# EAGLE design debugger-board (EAGLE 7.6.0)
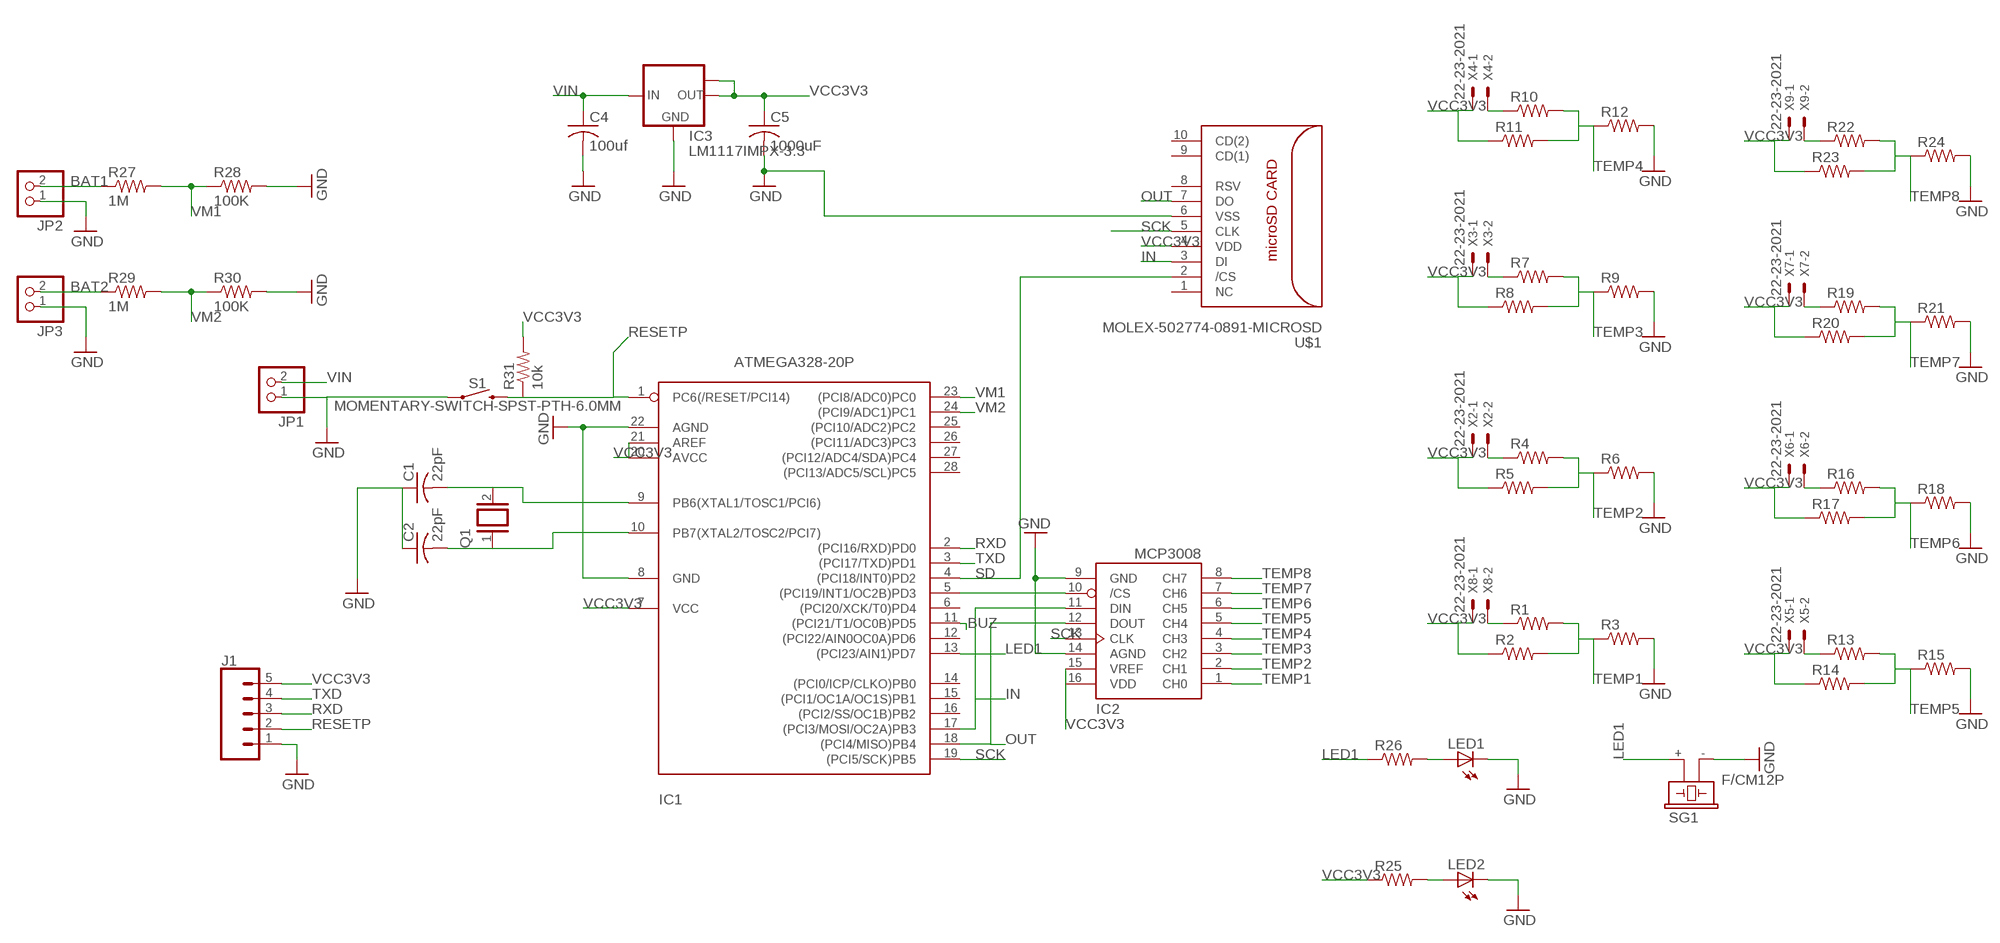
[diagram p0: schematic, sheet 1]

## Parts
C1  22pF  C-US050-025X075  [C050-025X075]
C2  22pF  C-US050-025X075  [C050-025X075]
C4  100uf  C-US050-025X075  [C050-025X075]
C5  1000uF  C-US050-025X075  [C050-025X075]
IC1  ATMEGA328-20P  [DIL28-3]
IC2  MCP3008  [DIL16]
IC3  LM1117IMPX-3.3  [SOT223]
J1  CONN_05PTH_LONGPADS  [1X05_LONGPADS]
JP1  PINHD-1X2  [1X02]
JP2  PINHD-1X2  [1X02]
JP3  PINHD-1X2  [1X02]
LED1  LED_ELD260  [LED_LD260]
LED2  LED_ELD260  [LED_LD260]
Q1  XTAL/S  [QS]
R1  R-US_0204/5  [0204/5]
R2  R-US_0204/5  [0204/5]
R3  R-US_0204/5  [0204/5]
R4  R-US_0204/5  [0204/5]
R5  R-US_0204/5  [0204/5]
R6  R-US_0204/5  [0204/5]
R7  R-US_0204/5  [0204/5]
R8  R-US_0204/5  [0204/5]
R9  R-US_0204/5  [0204/5]
R10  R-US_0204/5  [0204/5]
R11  R-US_0204/5  [0204/5]
R12  R-US_0204/5  [0204/5]
R13  R-US_0204/5  [0204/5]
R14  R-US_0204/5  [0204/5]
R15  R-US_0204/5  [0204/5]
R16  R-US_0204/5  [0204/5]
R17  R-US_0204/5  [0204/5]
R18  R-US_0204/5  [0204/5]
R19  R-US_0204/5  [0204/5]
R20  R-US_0204/5  [0204/5]
R21  R-US_0204/5  [0204/5]
R22  R-US_0204/5  [0204/5]
R23  R-US_0204/5  [0204/5]
R24  R-US_0204/5  [0204/5]
R25  R-US_0204/5  [0204/5]
R26  R-US_0204/5  [0204/5]
R27  1M  R-US_0204/5  [0204/5]
R28  100K  R-US_0204/5  [0204/5]
R29  1M  R-US_0204/5  [0204/5]
R30  100K  R-US_0204/5  [0204/5]
R31  10k  R-US_0207/7  [0207/7]
S1  MOMENTARY-SWITCH-SPST-PTH-6.0MM  [TACTILE_SWITCH_PTH_6.0MM]
SG1  F/CM12P  [F/CM12P]
U$1  MOLEX-502774-0891-MICROSD  [MOLEX-502774-0891-MICROSD]
X2  22-23-2021  [22-23-2021]
X3  22-23-2021  [22-23-2021]
X4  22-23-2021  [22-23-2021]
X5  22-23-2021  [22-23-2021]
X6  22-23-2021  [22-23-2021]
X7  22-23-2021  [22-23-2021]
X8  22-23-2021  [22-23-2021]
X9  22-23-2021  [22-23-2021]

## Nets
BAT1: JP2.2 R27.1
BAT2: JP3.2 R29.1
BUZ: IC1.11((PCI21/T1/OC0B)PD5)
GND: C1.1 C2.1 C4.2 C5.2 IC1.8(GND) IC1.22(AGND) IC2.9(GND) IC2.14(AGND) IC3.1(GND) J1.1 JP1.1 JP2.1 JP3.1 LED1.K(C) LED2.K(C) R3.2 R6.2 R9.2 R12.2 R15.2 R18.2 R21.2 R24.2 R28.2 R30.2 S1.1 SG1.- U$1.6(VSS)
IN: IC1.17((PCI3/MOSI/OC2A)PB3) IC2.11(DIN) U$1.3(DI)
LED1: IC1.13((PCI23/AIN1)PD7) R26.1 SG1.+
N$1: LED2.A R25.2
N$4: IC1.5((PCI19/INT1/OC2B)PD3) IC2.10(/CS)
N$5: C1.2 IC1.9(PB6(XTAL1/TOSC1/PCI6)) Q1.2
N$6: C2.2 IC1.10(PB7(XTAL2/TOSC2/PCI7)) Q1.1
N$7: R4.1 X2.2
N$8: R1.1 X8.2
N$10: LED1.A R26.2
N$11: R7.1 X3.2
N$13: R10.1 X4.2
N$15: R13.1 X5.2
N$17: R16.1 X6.2
N$19: R19.1 X7.2
N$21: R22.1 X9.2
OUT: IC1.18((PCI4/MISO)PB4) IC2.12(DOUT) U$1.7(DO)
RESETP: IC1.1(PC6(/RESET/PCI14)) J1.2 R31.1 S1.3
RXD: IC1.2((PCI16/RXD)PD0) J1.3
SCK: IC1.19((PCI5/SCK)PB5) IC2.13(CLK) U$1.5(CLK)
SD: IC1.4((PCI18/INT0)PD2) U$1.2(/CS)
TEMP1: IC2.1(CH0) R1.2 R2.2 R3.1
TEMP2: IC2.2(CH1) R4.2 R5.2 R6.1
TEMP3: IC2.3(CH2) R7.2 R8.2 R9.1
TEMP4: IC2.4(CH3) R10.2 R11.2 R12.1
TEMP5: IC2.5(CH4) R13.2 R14.2 R15.1
TEMP6: IC2.6(CH5) R16.2 R17.2 R18.1
TEMP7: IC2.7(CH6) R19.2 R20.2 R21.1
TEMP8: IC2.8(CH7) R22.2 R23.2 R24.1
TXD: IC1.3((PCI17/TXD)PD1) J1.4
VCC3V3: C5.1 IC1.7(VCC) IC1.20(AVCC) IC1.21(AREF) IC2.15(VREF) IC2.16(VDD) IC3.2(OUT) IC3.TAB(OUT1) J1.5 R2.1 R5.1 R8.1 R11.1 R14.1 R17.1 R20.1 R23.1 R25.1 R31.2 U$1.4(VDD) X2.1 X3.1 X4.1 X5.1 X6.1 X7.1 X8.1 X9.1
VIN: C4.1 IC3.3(IN) JP1.2
VM1: IC1.23((PCI8/ADC0)PC0) R27.2 R28.1
VM2: IC1.24((PCI9/ADC1)PC1) R29.2 R30.1
Unconnected: IC1.6((PCI20/XCK/T0)PD4) IC1.12((PCI22/AIN0OC0A)PD6) IC1.14((PCI0/ICP/CLKO)PB0) IC1.15((PCI1/OC1A/OC1S)PB1) IC1.16((PCI2/SS/OC1B)PB2) IC1.25((PCI10/ADC2)PC2) IC1.26((PCI11/ADC3)PC3) IC1.27((PCI12/ADC4/SDA)PC4) IC1.28((PCI13/ADC5/SCL)PC5) U$1.1(NC) U$1.8(RSV) U$1.9(CD(1)) U$1.10(CD(2))

## Library data of the parts
C1 C2 = adafruit:C-US: CAPACITOR, American symbol
C4 C5 = resistor:C-US: CAPACITOR, American symbol
IC1 = atmega328:ATMEGA328*P: MICROCONTROLLER 32 kBytes FLASH 2 kBytes SRAM 1 kBytes EEPROM USART 8-channel 10 bit ADC
IC2 = adafruit:MCP3008
IC3 = lm1117:LM1117IMPX-*
J1 = SparkFun-Connectors:CONN_05: Multi connection point. Often used as Generic Header-pin footprint for 0.1 inch spaced/style header connections On any of the 0.1 inch spaced packages, you can populate with these: Break Away Headers - Straight <https://www.sparkfun.com/products/116> (PRT-00116) Break Away Male Headers - Right Angle <https://www.sparkfun.com/products/553> (PRT-00553) Female Headers <https://www.sparkfun.com/products/115> (PRT-00115) Break Away Headers - Machine Pin <https://www.sparkfun.com/products/117> (PRT-00117) Break Away Female Headers - Swiss Machine Pin <https://www.sparkfun.com/products/743> (PRT-00743) For SCREWTERMINALS and SPRING TERMINALS visit here: Screw Terimnals on SparkFun.com <https://www.sparkfun.com/search/results?term=Screw+Terminals> (5mm/3.5mm/2.54mm spacing) This device is also useful as a general connection point to wire up your design to another part of your project. Our various solder wires solder well into these plated through hole pads. Hook-Up Wire - Assortment (Stranded, 22 AWG) <https://www.sparkfun.com/products/11375> (PRT-11375) Hook-Up Wire - Assortment (Solid Core, 22 AWG) <https://www.sparkfun.com/products/11367> (PRT-11367) View the entire wire category on our website here <https://www.sparkfun.com/categories/141> Special notes: Molex polarized connector foot print use with SKU : PRT-08231 with associated crimp pins and housings. 1MM SMD Version SKU: PRT-10208
JP1-JP3 = pinhead:PINHD-1X2: PIN HEADER
LED1 LED2 = eagle-ltspice:LED_E: LED Source: http://www.osram.convergy.de Source: www.luxeon.com Source: www.kingbright.com; SPICEMODEL: NONE; SPICEPREFIX: D; SPICETYPE: diode
Q1 = special:XTAL/S: CRYSTAL
R1-R30 = adafruit:R-US_: RESISTOR, American symbol
R31 = resistor:R-US_: RESISTOR, American symbol
S1 = SparkFun-Switches:MOMENTARY-SWITCH-SPST: Momentary Switch (Pushbutton) - SPST Normally-open (NO) SPST momentary switches (buttons, pushbuttons). Variants PTH-12MM - 12mm square, through-hole Momentary Pushbutton Switch - 12mm Square <https://www.sparkfun.com/products/9190> (COM-09190) PTH-6.0MM, PTH-6.0MM-KIT - 6.0mm square, through-hole Mini Pushbutton Switch <https://www.sparkfun.com/products/97> (COM-00097) KIT package intended for soldering kit's - only one side of pads' copper is exposed. PTH-RIGHT-ANGLE-KIT - Right-angle, through-hole Right Angle Tactile Button <https://www.sparkfun.com/products/10791> - Used on SparkFun BigTime Watch Kit <https://www.sparkfun.com/products/11734> SMD-12MM - 12mm square, surface-mount Tactile Button - SMD (12mm) <https://www.sparkfun.com/products/12993> (COM-12993) Used on SparkFun PicoBoard <https://www.sparkfun.com/products/11888> SMD-4.5MM - 4.5mm Square Trackball Switch Used on SparkFun Blackberry Trackballer Breakout <https://www.sparkfun.com/products/13169> SMD-4.6MMX2.8MM - 4.60mm x 2.80mm, surface mount Used on SparkFun SAMD21 Mini Breakout <https://www.sparkfun.com/products/13664> SMD-5.2MM, SMD-5.2-REDUNDANT - 5.2mm square, surface-mount Mini Pushbutton Switch - SMD <https://www.sparkfun.com/products/8720> (COM-08720) Used on Arduino Pro Mini <https://www.sparkfun.com/products/11114> REDUNDANT package connects both switch circuits together SMD-6.0X3.5MM - 6.0 x 3.5mm, surface mount Momentary Reset Switch SMD <https://www.sparkfun.com/products/8229> (COM-08229) SMD-6.2MM-TALL - 6.2mm square, surface mount Tactile Button - SMD (6mm) <https://www.sparkfun.com/products/12992> Used on SparkFun Digital Sandbox <https://www.sparkfun.com/products/12651> SMD-RIGHT-ANGLE - Right-angle, surface mount Used on SparkFun Block for Intel® Edison - Arduino <https://www.sparkfun.com/products/13036>; PROD_ID: SWCH-08441; SF_SKU: COM-00097
SG1 = buzzer:F/CM12P: BUZZER Source: Buerklin; OC_FARNELL: unknown; OC_NEWARK: unknown
U$1 = Ava:MOLEX-502774-0891-MICROSD; FARNELL: 2064063
X2-X9 = con-molex:22-23-2021: .100" (2.54mm) Center Header - 2 Pin; MF: MOLEX; MPN: 22-23-2021; OC_FARNELL: 1462926; OC_NEWARK: 25C3832

## Board
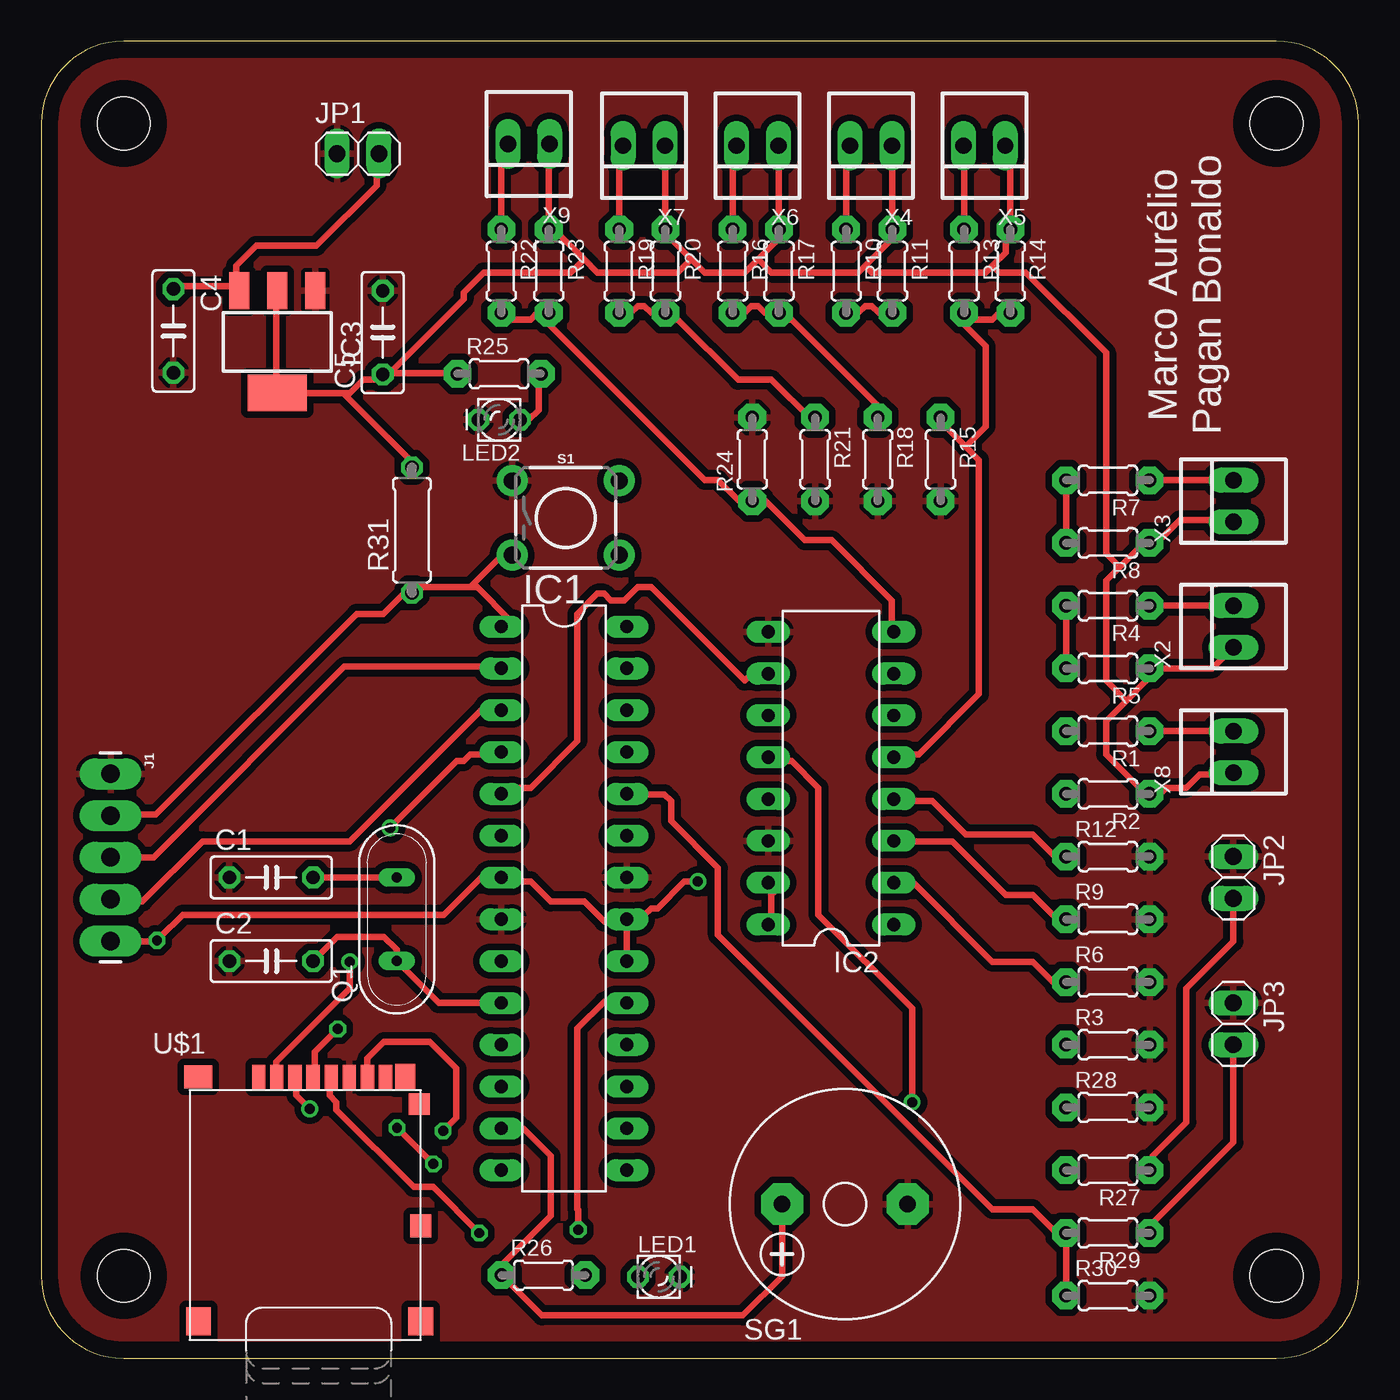
[diagram p1: board, top side]
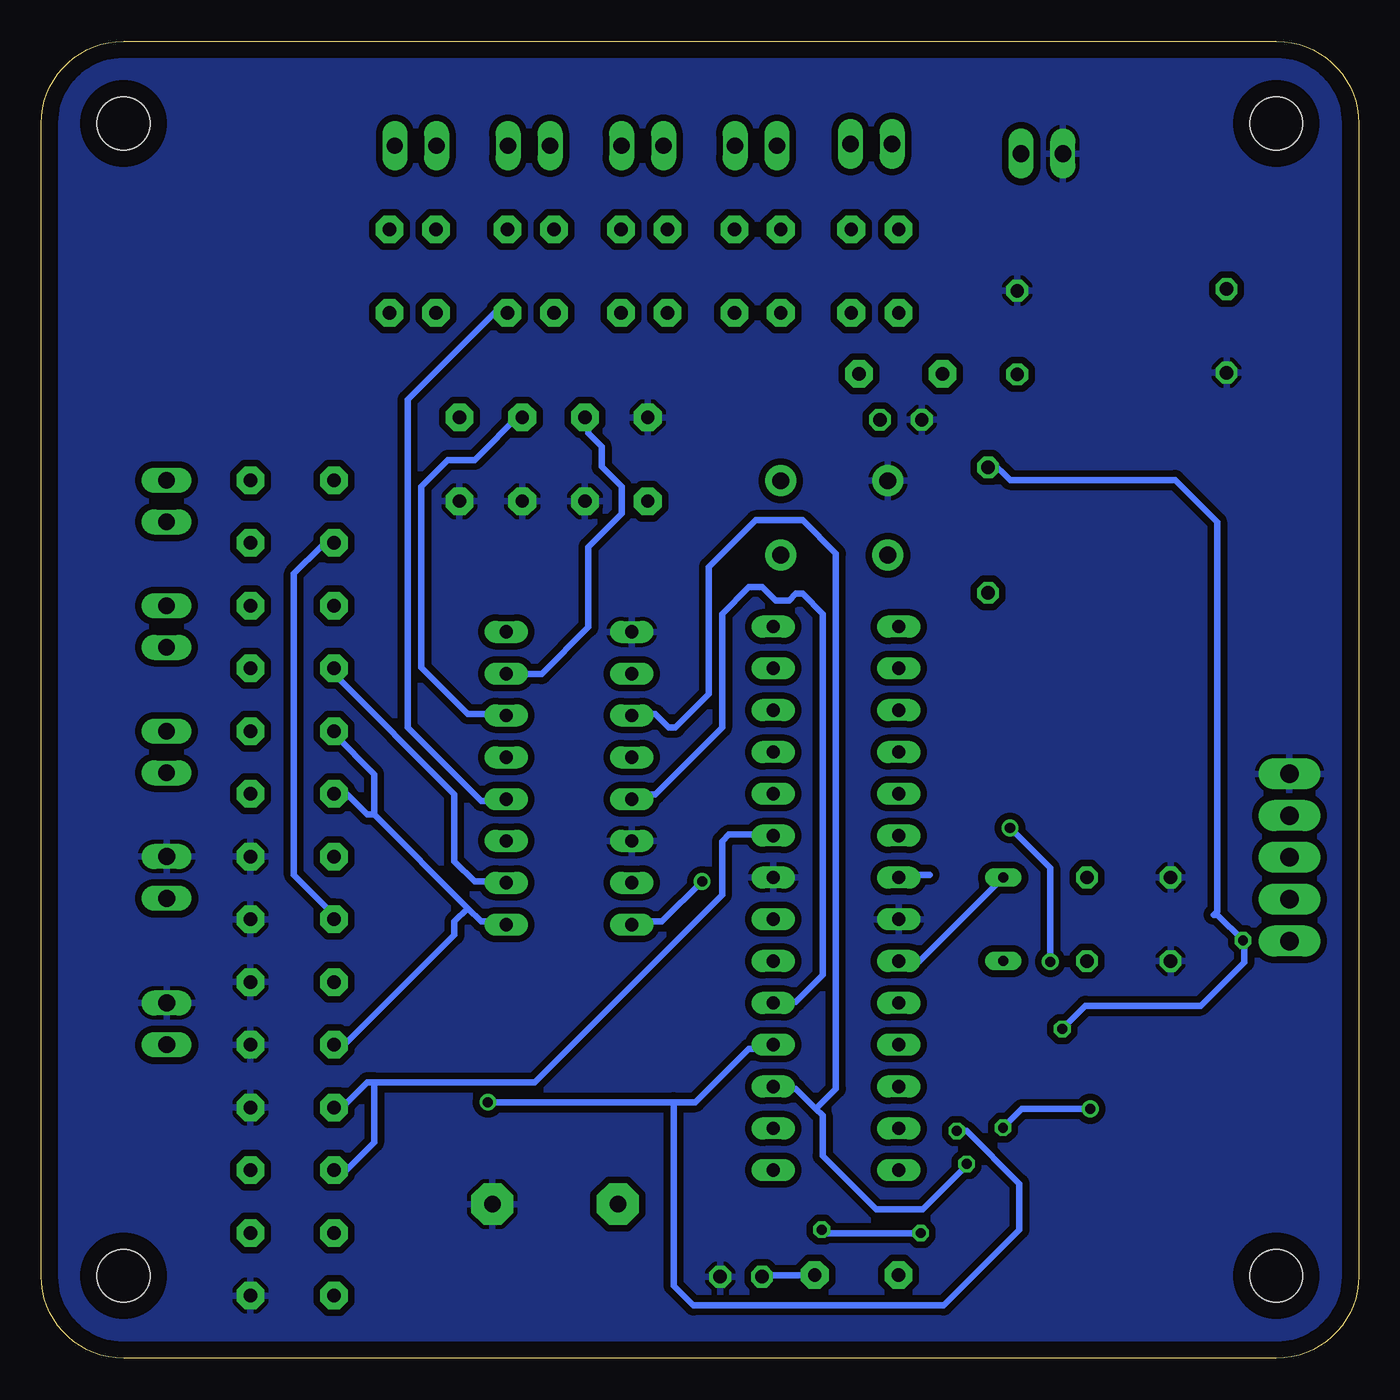
[diagram p2: board, bottom side, seen from below]

Size 80.01 x 80.01 mm. Coordinates in mm from the lower left corner, seen from the top.
Outline: 80.01,5 80.01,75.01 arc90 75.01,80.01 5,80.01 arc90 0,75.01 0,5 arc90 5,0 75.01,0 arc90 80.01,5
Copper layers (1*16): Top 0.035mm / dielectric 1.5mm / Bottom 0.035mm
Design rules "default *": minimum track width 16mil, minimum drill 24mil, track to track 16mil, track to pad 16mil, pad to pad 16mil, via to via 16mil, smd to smd 16mil, copper to edge 40mil, drill to drill 16mil, minimum pad ring 10mil, minimum via ring 8mil, stop-mask expansion 4mil, vias tented up to drill 0mil, thermal gap 10mil
Holes 3.2 mm at 75.01,75.01 75.01,5.01 5.01,5.01 5.01,75.01

### Footprints (pad centres in the part's own frame; a part is rotated, then mirrored left to right if it is on the bottom)
C050-025X075 = drill 0.813 octagon: 1 -2.54,0; 2 2.54,0
DIL28-3 = drill 0.813 long: 1 -16.51,-3.81; 2 -13.97,-3.81; 3 -11.43,-3.81; 4 -8.89,-3.81; 5 -6.35,-3.81; 6 -3.81,-3.81; 7 -1.27,-3.81; 8 1.27,-3.81; 9 3.81,-3.81; 10 6.35,-3.81; 11 8.89,-3.81; 12 11.43,-3.81; 13 13.97,-3.81; 14 16.51,-3.81; 15 16.51,3.81; 16 13.97,3.81; 17 11.43,3.81; 18 8.89,3.81; 19 6.35,3.81; 20 3.81,3.81; 21 1.27,3.81; 22 -1.27,3.81; 23 -3.81,3.81; 24 -6.35,3.81; 25 -8.89,3.81; 26 -11.43,3.81; 27 -13.97,3.81; 28 -16.51,3.81
DIL16 = drill 0.813 long: 1 -8.89,-3.81; 2 -6.35,-3.81; 3 -3.81,-3.81; 4 -1.27,-3.81; 5 1.27,-3.81; 6 3.81,-3.81; 7 6.35,-3.81; 8 8.89,-3.81; 9 8.89,3.81; 10 6.35,3.81; 11 3.81,3.81; 12 1.27,3.81; 13 -1.27,3.81; 14 -3.81,3.81; 15 -6.35,3.81; 16 -8.89,3.81
SOT223 = smd 1.219 x 2.235: 1 -2.311,-3.099; 2 0,-3.099; 3 2.311,-3.099 | smd 3.6 x 2.2: TAB 0,3.099
1X05_LONGPADS = drill 1.118 pad 1.88 long: 1 0,0; 2 2.54,0; 3 5.08,0; 4 7.62,0; 5 10.16,0
1X02 = drill 1.016 long: 1 -1.27,0; 2 1.27,0
LED_LD260 = drill 0.813 octagon: A -1.27,0; K 1.27,0
QS = drill 0.61 long: 1 -2.54,0; 2 2.54,0
0204/5 = drill 0.813 pad 1.676 octagon: 1 -2.54,0; 2 2.54,0
0207/7 = drill 0.813 octagon: 1 -3.81,0; 2 3.81,0
TACTILE_SWITCH_PTH_6.0MM = drill 1.016 pad 1.88: 1 -3.251,2.261; 2 3.251,2.261; 3 -3.251,-2.261; 4 3.251,-2.261
F/CM12P = drill 1.016 pad 2.54 octagon: + 3.81,0; - -3.81,0
MOLEX-502774-0891-MICROSD = smd 0.8 x 1.5: 1 -3.3,8.2; 2 -2.2,8.2; 3 -1.1,8.2; 4 0,8.2; 5 1.1,8.2; 6 2.2,8.2; 7 3.3,8.2; 8 4.4,8.2 | smd 1.29 x 1.3: 9 6.455,6.55 | smd 1.29 x 1.4: 10 6.54,-0.85 | smd 1.5 x 1.7: 11 6.54,-6.65; 12 -6.96,-6.65 | smd 1.7 x 1.4: 14 -6.96,8.2 | smd 1.2 x 1.6: 15 5.6,8.2
22-23-2021 = drill 1 long: 1 -1.27,0; 2 1.27,0

### Placement (x,y rotation side)
C1  13.97,29.21 0 top
C2  13.97,24.13 0 top
C4  8.03,62.41 270 top
C5  20.74,62.31 90 top
IC1  31.75,27.94 270 top
IC2  47.96,35.24 90 top
IC3  14.34,61.75 180 top
J1  4.21,35.51 270 top
JP1  19.24,73.18 0 top
JP2  72.39,29.21 270 top
JP3  72.39,20.32 270 top
LED1  37.51,4.96 0 top
LED2  27.81,57.01 180 top
Q1  21.59,26.67 90 top
R1  64.77,38.1 180 top
R2  64.77,34.29 180 top
R3  64.77,19.05 0 top
R4  64.77,45.72 180 top
R5  64.77,41.91 180 top
R6  64.77,22.86 0 top
R7  64.77,53.34 180 top
R8  64.77,49.53 180 top
R9  64.77,26.67 0 top
R10  48.88,66.04 270 top
R11  51.69,66.04 270 top
R12  64.77,30.48 0 top
R13  56.04,66.04 270 top
R14  58.85,66.04 270 top
R15  54.61,54.61 270 top
R16  41.99,66.04 270 top
R17  44.8,66.04 270 top
R18  50.8,54.61 270 top
R19  35.1,66.04 270 top
R20  37.91,66.04 270 top
R21  46.99,54.61 270 top
R22  27.94,66.04 270 top
R23  30.82,66.04 270 top
R24  43.18,54.61 90 top
R25  27.81,59.81 0 top
R26  30.5,5.05 0 top
R27  64.77,11.43 180 top
R28  64.77,15.24 0 top
R29  64.77,7.62 180 top
R30  64.77,3.81 0 top
R31  22.51,50.31 90 top
S1  31.85,51.05 0 top
SG1  48.8,9.37 180 top
U$1  16.51,8.89 0 top
X2  72.39,44.45 90 top
X3  72.39,52.07 90 top
X4  50.38,73.66 180 top
X5  57.27,73.66 180 top
X6  43.49,73.66 180 top
X7  36.6,73.66 180 top
X8  72.39,36.83 90 top
X9  29.61,73.76 180 top

### Tracks (layer width: path | path; a pad name or v marks a point on that pad's centre or on a via)
BAT1
  Top 0.406: JP2.2 72.39,27.75 72.39,25.31 69.54,22.47 69.54,14.34 67.51,12.31 67.51,11.49 R27.1
BAT2
  Top 0.406: JP3.2 72.39,18.81 72.39,13.12 67.1,7.84 R29.1
GND
  pour Bottom: 80.01,5 80.01,75.01 arc90 75.01,80.01 5,80.01 arc90 0,75.01 0,5 arc90 5,0 75.01,0 arc90
  pour Top: 0,5 0,75.01 arc-90 5,80.01 75.01,80.01 arc-90 80.01,75.01 80.01,5 arc-90 75.01,0 5,0 arc-90
IN  (via drill 0.6, 0.61)
  Top 0.406: v16.3,15.15 15.49,15.96 15.49,16.78 U$1.3 | v21.61,14.01 v23.81,11.81
  Bottom 0.406: v16.3,15.15 20.47,15.15 v21.61,14.01 | 32.97,15.15 34.19,16.37 35.4,16.37 IC1.17 | 32.97,15.15 32.56,14.75 32.56,12.31 29.31,9.06 26.46,9.06 23.81,11.71 v23.81,11.81 | 32.97,15.15 31.75,16.37 31.75,48.88 33.78,50.92 36.62,50.92 39.47,48.07 39.47,40.35 41.5,38.32 41.91,38.32 42.72,39.13 43.94,39.13 IC2.11
LED1
  Top 0.406: IC1.13 28.09,13.93 29.31,13.93 30.93,12.31 30.93,8.65 27.68,5.4 R26.1 30.4,2.61 42.61,2.61 44.99,4.99 SG1.+
N$1
  Top 0.406: LED2.A 29.61,57.01 30.21,57.61 30.21,59.67 R25.2
N$4
  Top 0.406: IC1.5 28.09,34.66 29.72,34.66 32.56,37.5 32.56,45.23 33.78,46.45 34.19,46.45 34.59,46.04 35.4,46.04 36.22,46.85 37.03,46.85 42.72,41.16 43.13,41.57 43.94,41.57 IC2.10
N$5
  Top 0.406: C1.2 Q1.2
  Bottom 0.406: Q1.2 26.67,24.13 IC1.9
N$6
  Top 0.406: C2.2 17.99,25.61 20.81,25.61 21.59,24.83 Q1.1 24.13,21.59 IC1.10
N$7
  Top 0.406: R4.1 X2.2
N$8
  Top 0.406: R1.1 X8.2
N$10
  Bottom 0.406: R26.2 36.15,5.05 LED1.A
N$11
  Top 0.406: R7.1 X3.2
N$13
  Top 0.406: R10.1 48.88,73.43 X4.2
N$15
  Top 0.406: R13.1 56.04,73.62 X5.2
N$17
  Top 0.406: R16.1 41.99,73.43 X6.2
N$19
  Top 0.406: R19.1 35.1,73.43 X7.2
N$21
  Top 0.406: R22.1 27.94,73.36 X9.2
OUT  (via drill 0.6, 0.61)
  Top 0.406: v52.88,15.56 52.88,21.25 47.19,26.94 47.19,34.66 45.56,36.28 44.35,36.28 IC2.12 | U$1.7 19.81,18.21 20.81,19.21 23.61,19.21 25.21,17.61 25.21,14.61 v24.41,13.81
  Bottom 0.406: v52.88,15.56 41.61,15.56 | 41.61,15.56 40.28,15.56 37.03,18.81 35.81,18.81 IC1.18 | v24.41,13.81 23.81,13.81 20.61,10.61 20.61,7.81 25.21,3.21 40.41,3.21 41.61,4.41 41.61,15.56
RESETP
  Top 0.406: 26.06,46.85 26.46,46.85 28.5,44.82 28.09,44.41 IC1.1 | 26.06,46.85 22.81,46.85 R31.1 22.4,46.85 20.77,45.23 19.15,45.23 6.96,33.03 4.52,33.03 J1.2 | 26.06,46.85 27.68,48.48 28.5,48.48 S1.3
RXD
  Top 0.406: J1.3 6.83,30.43 18.41,42.01 27.84,42.01 IC1.2
SCK  (via drill 0.6)
  Top 0.406: U$1.5 17.52,16.78 17.52,15.96 17.93,15.56 17.93,15.09 22.61,10.41 23.81,10.41 v26.61,7.61 | IC1.19 35.4,21.65 34.19,21.65 32.56,20.03 32.56,9.06 32.61,9.01 v32.61,7.81
  Bottom 0.406: IC2.13 43.94,34.25 42.72,34.25 38.66,38.32 38.66,45.23 37.03,46.85 36.22,46.85 35.4,46.04 34.59,46.04 34.19,46.45 33.78,46.45 32.56,45.23 32.56,23.28 34.19,21.65 35.4,21.65 IC1.19 | v26.61,7.61 32.41,7.61 v32.61,7.81
SD  (via drill 0.61)
  Top 0.406: v18.74,24.09 18.74,22.47 14.27,18 14.27,17.18 U$1.2 | v21.18,32.22 25.24,36.28 25.65,36.28 26.06,36.69 27.68,36.69 IC1.4
  Bottom 0.406: v18.74,24.09 18.74,29.78 v21.18,32.22
TEMP1
  Bottom 0.406: 59.79,33.03 54.1,27.34 | 54.1,27.34 53.29,26.53 52.07,26.53 IC2.1 | 59.79,33.03 60.2,33.03 61.41,34.25 62.23,34.25 R2.2 | 54.1,27.34 54.91,26.53 54.91,25.72 61.41,19.22 62.23,19.22 R3.1 | 59.79,33.03 59.79,35.47 62.23,37.91 R1.2
TEMP2
  Top 0.406: IC2.2 52.07,28.97 52.88,28.97 57.76,24.09 60.2,24.09 61.41,22.87 62.23,22.87 R6.1 | R5.2 R4.2
  Bottom 0.406: R5.2 62.23,41.57 54.91,34.25 54.91,30.19 53.69,28.97 52.07,28.97 IC2.2
TEMP3
  Top 0.406: IC2.3 52.07,31.41 55.32,31.41 58.57,28.16 60.2,28.16 61.41,26.94 62.23,26.94 R9.1 | R7.2 R8.2
  Bottom 0.406: R8.2 62.63,49.29 63.04,49.29 64.67,47.66 64.67,29.38 62.63,27.34 62.23,27.34 61.82,26.94 62.23,26.53 R9.1
TEMP4
  Top 0.406: R10.2 49.22,63.51 49.63,63.51 50.04,63.92 50.44,63.92 50.85,63.51 51.66,63.51 R11.2 | IC2.4 52.07,33.85 54.1,33.85 56.13,31.81 60.2,31.81 61.41,30.6 62.23,30.6 R12.1
  Bottom 0.406: R11.2 52.07,63.51 52.47,63.51 57.76,58.23 57.76,38.32 53.29,33.85 52.07,33.85 IC2.4
TEMP5
  Top 0.406: 56.13,63.11 57.76,63.11 58.16,63.51 58.57,63.51 R14.2 | 56.13,55.39 54.51,57.01 R15.1 | 56.13,55.39 56.94,54.57 56.94,40.35 53.29,36.69 52.07,36.69 IC2.5 | 56.13,63.11 56.13,62.7 57.35,61.48 57.35,56.61 56.13,55.39 | 56.13,63.11 R13.2
TEMP6
  Top 0.406: R16.2 42.31,63.51 42.72,63.51 43.13,63.92 43.53,63.92 43.94,63.51 44.75,63.51 R17.2 45.16,63.11 45.56,63.11 51.25,57.42 50.85,57.01 R18.1
  Bottom 0.406: IC2.6 52.07,39.13 54.1,39.13 56.94,41.97 56.94,52.95 55.32,54.57 53.69,54.57 50.85,57.42 R18.1
TEMP7
  Top 0.406: R19.2 35.4,63.51 35.81,63.51 36.22,63.92 36.62,63.92 37.03,63.51 37.84,63.51 R20.2 38.25,63.11 38.66,63.11 42.31,59.45 44.35,59.45 46.78,57.01 R21.1
  Bottom 0.406: IC2.7 51.66,41.57 49.63,41.57 46.78,44.41 46.78,49.29 44.75,51.32 44.75,52.95 45.97,54.17 45.97,55.39 46.78,56.2 46.78,57.01 R21.1
TEMP8
  Top 0.406: R22.2 28.09,63.11 29.72,63.11 30.12,63.51 30.53,63.51 R23.2 30.93,63.11 30.93,62.7 40.28,53.35 41.09,53.35 42.31,52.14 43.13,52.14 | 43.13,52.14 43.53,52.54 46.38,49.7 48,49.7 51.66,46.04 51.66,44.41 IC2.8 | 43.13,52.14 R24.1
TXD
  Top 0.406: IC1.3 27.68,39.54 26.87,39.54 18.74,31.41 9.8,31.41 6.14,27.75 4.52,27.75 J1.4
VCC3V3  (via drill 0.6, 0.61)
  Top 0.406: IC2.16 44.35,26.53 44.35,28.16 44.75,28.56 44.35,28.97 IC2.15 | 35,26.53 35.4,26.94 IC1.21 | 35,26.53 34.19,26.53 32.97,27.75 30.93,27.75 29.72,28.97 28.09,28.97 IC1.7 27.68,29.38 26.87,29.38 24.43,26.94 8.58,26.94 7.23,25.59 | 35,26.53 IC1.21 | v39.88,28.97 39.06,28.97 37.44,27.34 37.03,27.34 36.62,26.94 35.81,26.94 IC1.21 | 7.23,25.59 v7.03,25.39 | v7.03,25.39 6.96,25.31 4.52,25.31 J1.5 | X3.1 72.39,50.92 69.14,50.92 67.51,49.29 R8.1 67.1,49.29 66.7,49.29 65.48,48.07 | X8.1 72.39,35.47 70.36,35.47 69.54,34.66 68.32,34.66 67.92,34.25 67.51,34.25 R2.1 67.1,34.66 66.7,34.66 64.67,36.69 64.67,38.72 65.88,39.94 | 65.88,39.94 67.1,41.16 66.7,41.57 66.7,41.97 67.1,41.97 R5.1 71.12,41.91 X2.1 | 65.48,48.07 64.67,47.26 64.67,41.16 65.88,39.94 | IC3.2 14.27,64.73 14.27,59.04 IC3.TAB 14.68,58.64 18.34,58.64 | 18.34,58.64 18.74,58.64 19.56,59.45 20.37,59.45 C5.1 20.77,59.86 21.18,59.86 | 18.34,58.64 22.4,54.57 22.4,54.17 R31.2 | 39.47,66.77 40.28,65.95 42.72,65.95 43.53,66.77 | 39.47,66.77 38.25,67.98 38.25,68.39 R20.1 37.91,73.62 X7.1 | 43.53,66.77 45.16,68.39 R17.1 44.8,73.62 X6.1 | 50.04,66.36 49.63,65.95 44.35,65.95 43.53,66.77 | 50.04,66.36 51.66,67.98 51.66,68.39 R11.1 51.69,73.62 X4.1 | 57.76,66.36 57.35,65.95 50.44,65.95 50.04,66.36 | 57.76,66.36 58.57,67.17 58.57,68.39 R14.1 58.85,73.35 X5.1 | 32.97,66.77 33.78,65.95 38.66,65.95 39.47,66.77 | 32.97,66.77 31.34,68.39 30.93,68.39 R23.1 30.82,73.7 X9.1 | 21.18,59.86 25.65,64.33 25.65,64.73 26.87,65.95 32.15,65.95 32.97,66.77 | 65.48,48.07 64.67,48.88 64.67,61.08 59.79,65.95 58.16,65.95 57.76,66.36 | U$1.4 16.61,17.09 16.61,18.61 v18.01,20.01
  Top 0.406: v7.03,25.39 7.03,25.59 7.23,25.59 | 21.18,59.86 25.22,59.86 R25.1 | IC1.20 IC1.21
  Bottom 0.406: v39.88,28.97 42.31,26.53 43.94,26.53 IC2.16 | 26.06,29.38 27.68,29.38 IC1.7 | R31.2 22.81,54.17 22.4,54.57 21.18,53.35 11.15,53.35 8.61,50.81 8.61,27.14 8.81,26.94 8.58,26.94 v7.03,25.39 6.96,25.39 6.96,24.06 9.61,21.41 16.61,21.41 v18.01,20.01
VIN
  Top 0.406: 11.83,65.14 8.18,65.14 C4.1 | 11.83,65.14 11.83,66.36 13.05,67.58 16.71,67.58 20.37,71.24 20.37,72.86 JP1.2 | 11.83,65.14 IC3.3
VM1
  Bottom 0.406: 59.79,16.78 60.2,16.78 61.41,15.56 62.23,15.56 R28.1 | 59.79,16.78 50.04,16.78 38.66,28.16 38.66,31.41 38.25,31.81 35.81,31.81 IC1.23 | 59.79,16.78 59.79,13.12 61.41,11.49 62.23,11.49 R27.2
VM2
  Top 0.406: IC1.24 35.81,34.25 37.84,34.25 38.25,33.85 38.25,32.63 41.09,29.78 41.09,25.72 57.76,9.06 60.2,9.06 61.41,7.84 62.23,7.84 R29.2 R30.1

### Text on the board
tPlace: Marco Aurélio / Pagan Bonaldo